# EAGLE design TT7-40 v1.1 (EAGLE 7.1.0)
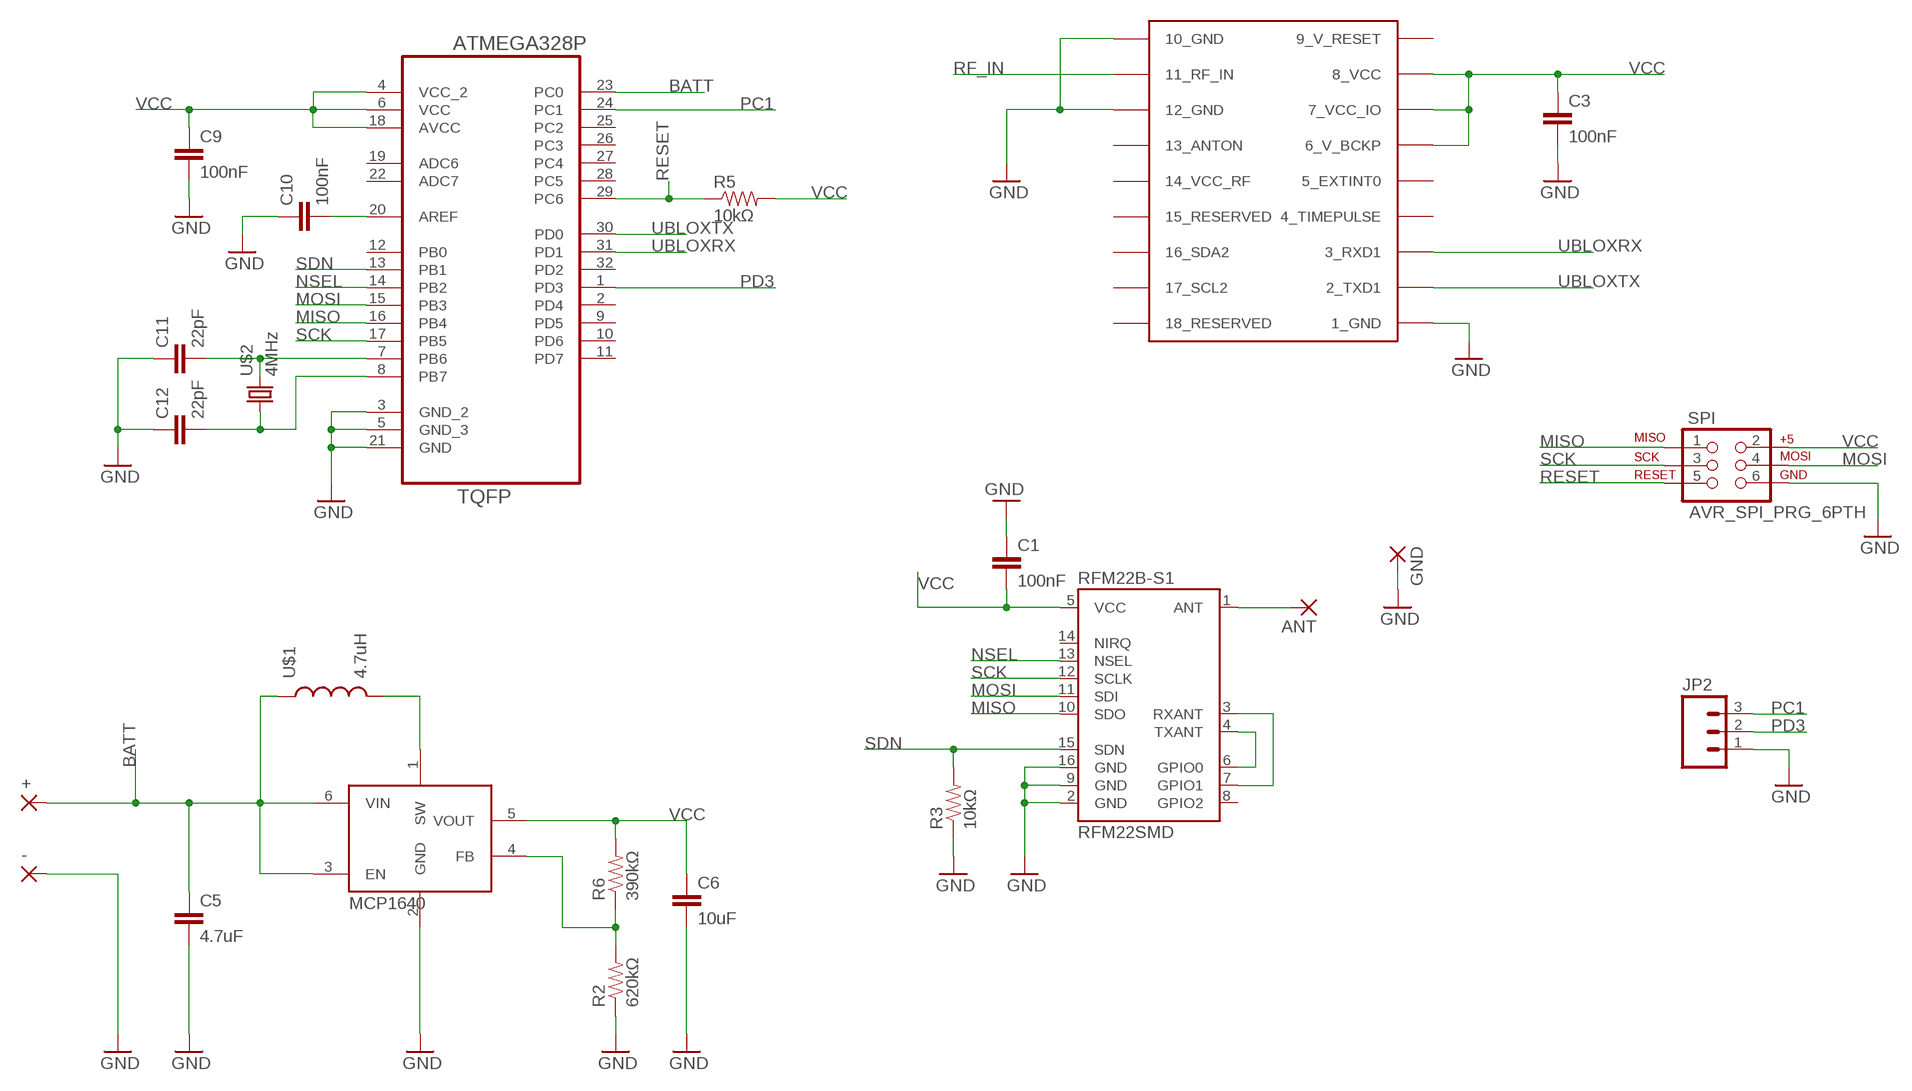
[diagram p0: schematic, sheet 1]

## Parts
+  WIREPADSMD1,27-254  [SMD1,27-2,54]
-  WIREPADSMD1,27-254  [SMD1,27-2,54]
ANT  WIREPADSMD1,27-254  [SMD1,27-2,54]
C1  100nF  CAP1206  [1206]
C3  100nF  CAP1206  [1206]
C5  4.7uF  CAP1206  [1206]
C6  10uF  CAP1206  [1206]
C9  100nF  CAP1206  [1206]
C10  100nF  CAP1206  [1206]
C11  22pF  CAP0805  [0805]
C12  22pF  CAP0805  [0805]
GND  WIREPADSMD1,27-254  [SMD1,27-2,54]
JP2  M03PTH  [1X03]
R2  620kΩ  RESISTOR0805-RES  [0805]
R3  10kΩ  RESISTOR0603-RES  [0603-RES]
R5  10kΩ  RESISTOR0603-RES  [0603-RES]
R6  390kΩ  RESISTOR0805-RES  [0805]
RFM22B-S1  RFM22SMD  [RFM22-XXX-S2]
SPI  AVR_SPI_PRG_6PTH  [2X3]
U2  MCP1640  [SOT23-6]
U3  ATMEGA328P-AU  [QFP80P900X900X120-32N]
U$1  4.7uH  DER07050705  [DER0705]
U$2  4MHz  ABRACON_ABM3_CRYSTALABM03_HC49  [ABM03_HC49]
UBLOX-MAX7C  UBLOX_MAX  [UBLOX_MAX]

## Nets
BATT: +.1(P) C5.1 U2.3(EN) U2.6(VIN) U3.23(PC0) U$1.P$1
GND: -.1(P) C1.1 C3.2 C5.2 C6.2 C9.2 C10.1 C11.1 C12.1 GND.1(P) JP2.1 R2.1 R3.1 RFM22B-S1.2(GND) RFM22B-S1.9(GND) RFM22B-S1.16(GND) SPI.6 U2.2(GND) U3.3(GND_2) U3.5(GND_3) U3.21(GND) UBLOX-MAX7C.1_GND UBLOX-MAX7C.10_GND UBLOX-MAX7C.12_GND
MISO: RFM22B-S1.10(SDO) SPI.1 U3.16(PB4)
MOSI: RFM22B-S1.11(SDI) SPI.4 U3.15(PB3)
N$2: RFM22B-S1.4(TXANT) RFM22B-S1.6(GPIO0)
N$3: RFM22B-S1.3(RXANT) RFM22B-S1.7(GPIO1)
N$10: ANT.1(P) RFM22B-S1.1(ANT)
N$22: U2.1(SW) U$1.P$2
N$33: C11.2 U3.7(PB6) U$2.2
N$34: R2.2 R6.1 U2.4(FB)
N$42: C12.2 U3.8(PB7) U$2.1
N$63: C10.2 U3.20(AREF)
NSEL: RFM22B-S1.13(NSEL) U3.14(PB2)
PC1: JP2.3 U3.24(PC1)
PD3: JP2.2 U3.1(PD3)
RESET: R5.1 SPI.5 U3.29(PC6)
RF_IN: UBLOX-MAX7C.11_RF_IN
SCK: RFM22B-S1.12(SCLK) SPI.3 U3.17(PB5)
SDN: R3.2 RFM22B-S1.15(SDN) U3.13(PB1)
UBLOXRX: U3.31(PD1) UBLOX-MAX7C.3_RXD1
UBLOXTX: U3.30(PD0) UBLOX-MAX7C.2_TXD1
VCC: C1.2 C3.1 C6.1 C9.1 R5.2 R6.2 RFM22B-S1.5(VCC) SPI.2 U2.5(VOUT) U3.4(VCC_2) U3.6(VCC) U3.18(AVCC) UBLOX-MAX7C.6_V_BCKP UBLOX-MAX7C.7_VCC_IO UBLOX-MAX7C.8_VCC
Unconnected: RFM22B-S1.8(GPIO2) RFM22B-S1.14(NIRQ) U3.2(PD4) U3.9(PD5) U3.10(PD6) U3.11(PD7) U3.12(PB0) U3.19(ADC6) U3.22(ADC7) U3.25(PC2) U3.26(PC3) U3.27(PC4) U3.28(PC5) U3.32(PD2) UBLOX-MAX7C.4_TIMEPULSE UBLOX-MAX7C.5_EXTINT0 UBLOX-MAX7C.13_ANTON UBLOX-MAX7C.14_VCC_RF UBLOX-MAX7C.15_RESERVED UBLOX-MAX7C.16_SDA2 UBLOX-MAX7C.17_SCL2 UBLOX-MAX7C.18_RESERVED

## Power pins joined to a net without a drawn wire
9_V_RESET: UBLOX-MAX7C.9_V_RESET

## Library data of the parts
+ - ANT GND = wirepad:WIREPAD: Wire PAD connect wire on PCB
C1 C3 C5 C6 C9-C12 = SparkFun-Capacitors:CAP: Capacitor Standard 0603 ceramic capacitor, and 0.1" leaded capacitor.
JP2 = SparkFun-Connectors:M03: Header 3 Standard 3-pin 0.1" header. Use with straight break away headers (SKU : PRT-00116), right angle break away headers (PRT-00553), swiss pins (PRT-00743), machine pins (PRT-00117), and female headers (PRT-00115). Molex polarized connector foot print use with SKU : PRT-08232 with associated crimp pins and housings.
R2 R6 = SparkFun-Resistors:RESISTOR: Resistor Basic schematic elements and footprints for 0603, 1206, and PTH resistors.
R3 R5 = SparkFun-Passives:RESISTOR: Resistor Basic schematic elements and footprints for 0603, 1206, and PTH resistors.
RFM22B-S1 = SparkFun-RF:RFM22: The RFM22 is a low-power, low cost radio that is capable of operating in the 434MHz and 900MHz open bands. It's frequency is software defined and there are some very good libraries written for it.
SPI = SparkFun-Connectors:AVR_SPI_PRG_6: AVR ISP 6 Pin This is the reduced ISP connector for AVR programming. Common on Arduino. This footprint will take up less PCB space and can be used with a 10-pin to 6-pin adapter such as SKU: BOB-08508 **Special note about "TEST_POINT" package. The stop mask is on the top side, so if you want your programming test points to be on the bottom of your board, make sure to place this package on the bottom side of the board. This also ensure that the orientation to program from the bottom side will be correct.
U2 = karlnet-parts:MCP1640: MCP1623, 1624, 1640/B/C/D pwm/pfm or pwm only DC/DC converters, in SOT-23
U3 = Ava:ATMEGA328P-AU; DESCRIPTION: 8-bit Microcontroller with In-System Programmable Flash; MPN: ATMEGA328P-AU; OC_FARNELL: 1715486; OC_NEWARK: 14R4631; PACKAGE: TQFP-32; SUPPLIER: Atmel
U$1 = SparkFun-Passives:DER0705: Inductor DER0705
U$2 = Ava:ABRACON_ABM3_CRYSTAL
UBLOX-MAX7C = Ava:UBLOX_MAX: UBLOX MAX

## Board
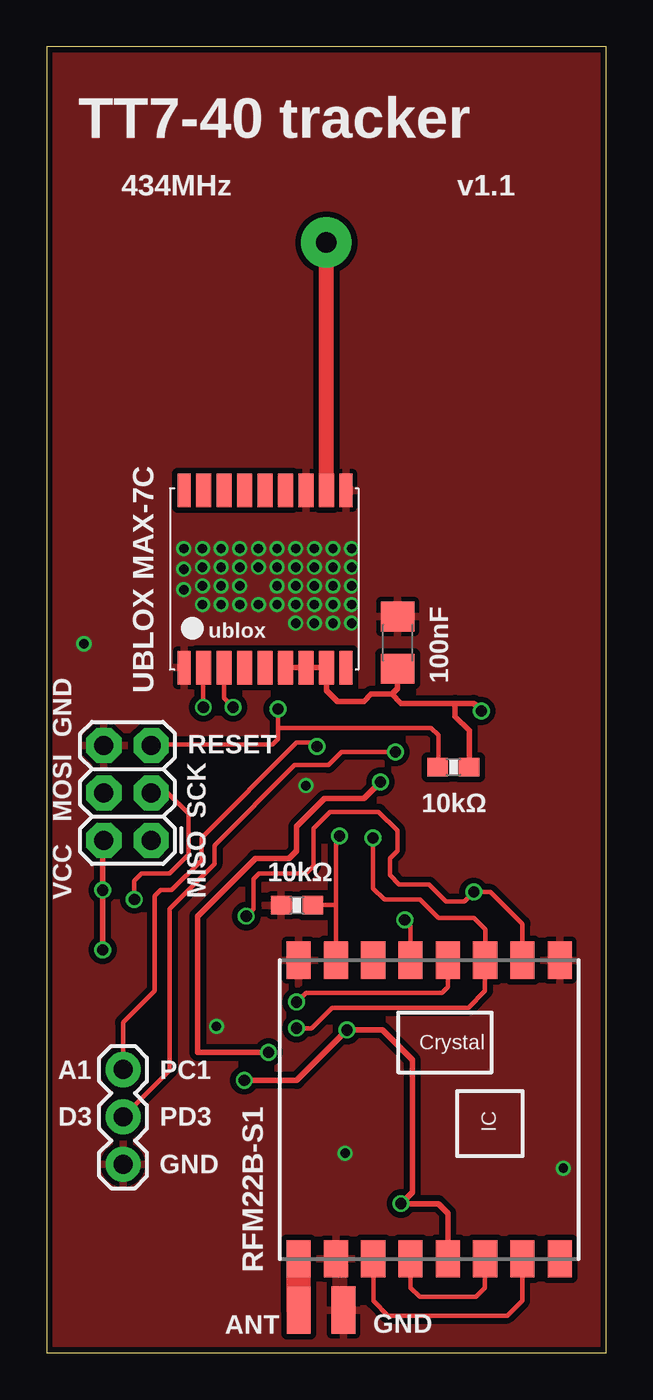
[diagram p1: board, top side]
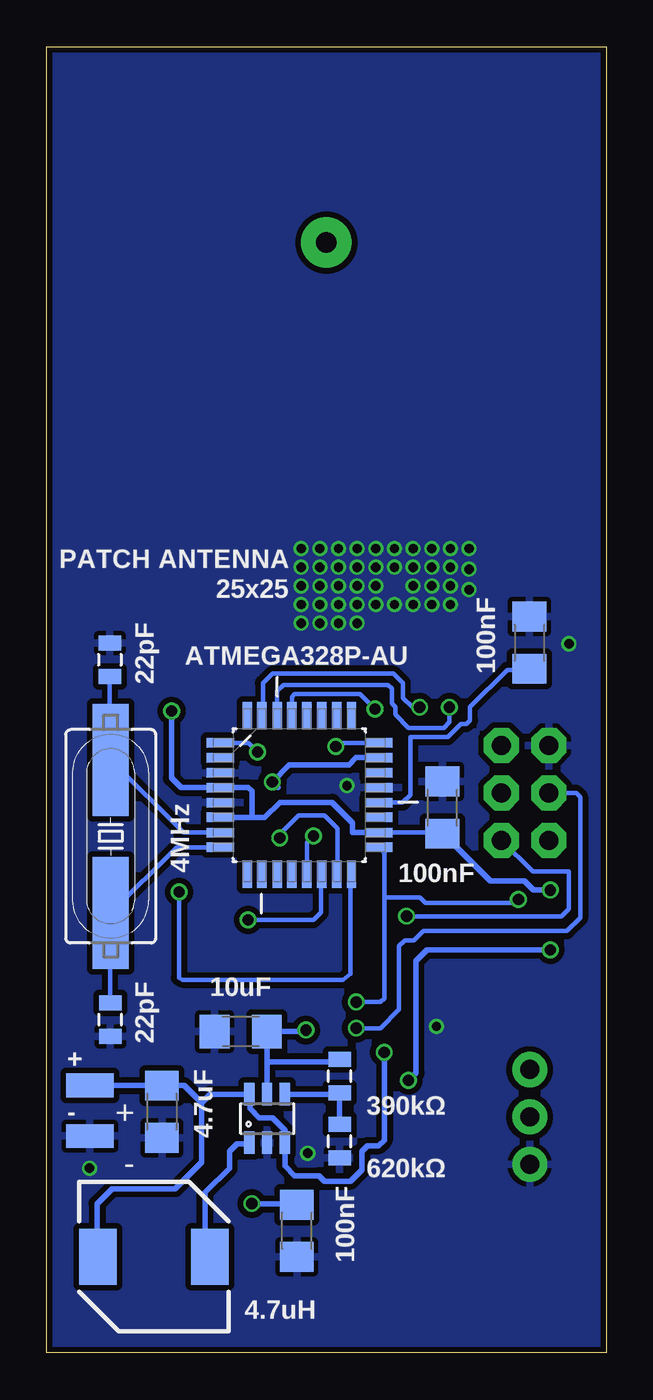
[diagram p2: board, bottom side, seen from below]

Size 30 x 70 mm. Coordinates in mm from the lower left corner, seen from the top.
Outline: 0,0 30,0 30,70 0,70 0,0
Copper layers (1*16): Top 0.035mm / dielectric 1.5mm / Bottom 0.035mm
Design rules "dirt_cheap_dirty_boards.v1": minimum track width 5mil, minimum drill 12mil, track to track 5mil, track to pad 5mil, pad to pad 5mil, via to via 5mil, smd to smd 0mil, copper to edge 10mil, drill to drill 10mil, minimum pad ring 10mil, minimum via ring 6mil, stop-mask expansion 2mil, vias tented up to drill 25mil, thermal gap 10mil

### Footprints (pad centres in the part's own frame; a part is rotated, then mirrored left to right if it is on the bottom)
SMD1,27-2,54 = smd 1.27 x 2.54: 1 0,0
1206 = smd 1.6 x 1.8: 1 -1.4,0; 2 1.4,0
0805 = smd 0.8 x 1.2: 1 -0.9,0; 2 0.9,0
1X03 = drill 1.016 pad 1.88: 1 0,0; 2 2.54,0; 3 5.08,0
0603-RES = smd 1.1 x 1: 1 -0.85,0; 2 0.85,0
RFM22-XXX-S2 = smd 2 x 1.3: 1 -8,7; 2 -8,5; 3 -8,3; 4 -8,1; 5 -8,-1; 6 -8,-3; 7 -8,-5; 8 -8,-7; 9 8,-7; 10 8,-5; 11 8,-3; 12 8,-1; 13 8,1; 14 8,3; 15 8,5; 16 8,7
2X3 = drill 1.016 pad 1.88 octagon: 1 0,0; 2 0,2.54; 3 2.54,0; 4 2.54,2.54; 5 5.08,0; 6 5.08,2.54
SOT23-6 = smd 0.55 x 1.2: 1 -0.95,-1.3; 2 0,-1.3; 3 0.95,-1.3; 4 0.95,1.3; 5 0,1.3; 6 -0.95,1.3
QFP80P900X900X120-32N = smd 1.473 x 0.508: 1 -4.242,2.794; 2 -4.242,2.007; 3 -4.242,1.194; 4 -4.242,0.406; 5 -4.242,-0.406; 6 -4.242,-1.194; 7 -4.242,-2.007; 8 -4.242,-2.794; 17 4.242,-2.794; 18 4.242,-2.007; 19 4.242,-1.194; 20 4.242,-0.406; 21 4.242,0.406; 22 4.242,1.194; 23 4.242,2.007; 24 4.242,2.794 | smd 0.508 x 1.473: 9 -2.794,-4.242; 10 -2.007,-4.242; 11 -1.194,-4.242; 12 -0.406,-4.242; 13 0.406,-4.242; 14 1.194,-4.242; 15 2.007,-4.242; 16 2.794,-4.242; 25 2.794,4.242; 26 2.007,4.242; 27 1.194,4.242; 28 0.406,4.242; 29 -0.406,4.242; 30 -1.194,4.242; 31 -2.007,4.242; 32 -2.794,4.242
DER0705 = smd 2 x 3: P$1 -3,0; P$2 3,0
ABM03_HC49 = smd 6 x 1.93: 1 -4.1,0; 2 4.1,0
UBLOX_MAX = smd 1.8 x 0.7: 1_GND 4.95,-4.4; 9_V_RESET 4.95,4.3; 10_GND -4.55,4.3; 18_RESERVED -4.55,-4.4 | smd 1.8 x 0.8: 2_TXD1 4.95,-3.35; 3_RXD1 4.95,-2.25; 4_TIMEPULSE 4.95,-1.15; 5_EXTINT0 4.95,-0.05; 6_V_BCKP 4.95,1.05; 7_VCC_IO 4.95,2.15; 8_VCC 4.95,3.25; 11_RF_IN -4.55,3.25; 12_GND -4.55,2.15; 13_ANTON -4.55,1.05; 14_VCC_RF -4.55,-0.05; 15_RESERVED -4.55,-1.15; 16_SDA2 -4.55,-2.25; 17_SCL2 -4.55,-3.35

### Placement (x,y rotation side)
+  27.68,14.33 90 bottom
-  27.68,11.62 90 bottom
ANT  13.51,2.28 0 top
C1  16.58,6.54 90 bottom
C3  18.82,38.06 90 top
C5  23.82,12.92 270 bottom
C6  19.6,17.22 180 bottom
C9  8.78,29.22 90 bottom
C10  4.12,38.06 270 bottom
C11  26.61,37.14 270 bottom
C12  26.59,17.85 90 bottom
GND  15.91,2.29 0 top
JP2  4.1,10.1 90 top
R2  14.29,11.34 90 bottom
R3  13.42,23.99 0 top
R5  21.81,31.39 0 top
R6  14.29,14.83 90 bottom
RFM22B-S1  20.51,13.04 90 top
SPI  5.61,27.47 90 top
U2  18.18,12.56 0 bottom
U3  16.45,29.89 0 bottom
U$1  24.25,5.16 0 bottom
U$2  26.56,27.68 90 bottom
UBLOX-MAX7C  11.76,41.67 270 top

### Tracks (layer width: path | path; a pad name or v marks a point on that pad's centre or on a via)
BATT  (via drill 0.6)
  Top 0.305: v17.9,30.6 17,29.7 14.9,29.7 13.4,28.2 13.4,26.9 13,26.5 11.2,26.5 8.1,23.4 8.1,16.1 v11.9,16.1
  Bottom 0.305: +.1 C5.1 | C5.1 | C5.1 22.63,14.33 21.7,13.4 | 21.7,13.4 21.7,10.2 23.1,8.8 26.5,8.8 27.3,8 27.3,5.21 U$1.P$1 | 21.7,13.4 21.24,13.86 U2.6 19.1,13.83 19.1,13.1 18.6,12.6 17.9,12.6 17.23,11.93 U2.3 17.23,10.03 16.7,9.5 15.4,9.5 15.1,9.2 13.7,9.2 13.1,9.8 13.1,10.8 12.8,11.1 12.2,11.1 11.9,11.4 v11.9,16.1 | U3.23 13.4,31.9 13.8,31.5 17,31.5 v17.9,30.6 17.6,30.3
GND  (via drill 0.5, 0.5 pad 0.25)
  other vias: 27.7,9.9 2,38 13.9,30.4 16,10.7 9.1,17.5 7.35,43.1 7.35,42 7.35,40.9 8.35,43.1 9.35,43.1 10.35,43.1 11.35,43.1 12.35,43.1 13.35,43.1 14.35,43.1 15.35,43.1 15.35,42.1 15.35,41.1 15.35,40.1 15.35,39.1 14.35,39.1 13.35,39.1 13.35,40.1 14.35,40.1 14.35,41.1 13.35,41.1 13.35,42.1 14.35,42.1 12.35,42.1 11.35,42.1 12.35,41.1 12.35,40.1 11.35,40.1 10.35,40.1 9.35,40.1 8.35,40.1 8.35,41.1 8.35,42.1 9.35,42.1 10.35,42.1 10.35,41.1 9.35,41.1 16.35,39.1 16.35,40.1 16.35,41.1 16.35,42.1 16.35,43.1
  pour Bottom (isolate 0.305): 0,70 30,70 30,0 0,0
  pour Top (isolate 0.305): 0,70 30,70 30,0 0,0
MISO  (via drill 0.6)
  Top 0.254: RFM22B-S1.10 25.51,22.99 23.8,24.7 v22.9,24.7 22.4,24.2 21.4,24.2 20.5,25.1 18.9,25.1 18.4,25.6 18.4,26.5 18.8,26.9 18.8,28 17.8,29 15.2,29 14.3,28.1 14.3,26.1 13.9,25.7 11.4,25.7 11.1,25.4 11.1,23.8 v10.7,23.4
  Bottom 0.254: v22.9,24.7 22.9,20.1 22.7,20 14.1,20 13.7,20.3 13.7,25.6 U3.16 | v10.7,23.4 2.4,23.4 2,23.8 2,25.8 3.94,25.8 SPI.1
MOSI  (via drill 0.6)
  Top 0.254: v17.5,27.6 17.5,24.9 18.1,24.3 20,24.3 21,23.3 22.9,23.3 23.51,22.69 RFM22B-S1.11 23.5,19.4 22.6,18.5 15.3,18.5 14.2,17.4 v13.4,17.4
  Bottom 0.254: v17.5,27.6 17.5,27.8 16.5,28.8 15.1,28.8 14.4,28.1 14.4,25.69 U3.15 | SPI.4 1.61,30.01 1.4,29.8 1.4,23.3 2.1,22.6 9.8,22.6 10.3,22.1 10.8,22.1 11.1,21.8 11.1,18.4 12.1,17.4 v13.4,17.4
N$2
  Top 0.254: RFM22B-S1.4 19.51,3.49 20,3 23,3 23.5,3.5 RFM22B-S1.6
N$3
  Top 0.254: RFM22B-S1.3 17.51,2.79 18.3,2 24.7,2 25.5,2.8 RFM22B-S1.7
N$10
  Top 0.254: 13.51,2.3 ANT.1
  Top 1.3: RFM22B-S1.1 13.51,2.3
N$22
  Bottom 0.305: U$1.P$2 21.5,5.41 21.5,8.6 20.2,9.9 20.2,10.8 19.8,11.2 19.19,11.2 U2.1
N$33
  Bottom 0.254: U3.7 22.66,27.88 U$2.2 26.61,31.83 C11.2
N$34
  Bottom 0.305: U2.4 14.66,13.86 R6.1 R2.2
N$42
  Bottom 0.254: U3.8 23.04,27.1 U$2.1 26.59,23.55 C12.2
N$63
  Bottom 0.254: U3.20 10.92,29.48 10.5,29.9 10.5,33 8.5,33 7.8,33.7 7.5,33.7 7.3,33.9 7.3,34.6 5.3,36.6 4.18,36.6 C10.2
NSEL  (via drill 0.6)
  Top 0.254: RFM22B-S1.13 19.51,22.89 v19.2,23.2
  Bottom 0.254: v19.2,23.2 15.7,23.2 15.3,23.6 15.3,25.6 U3.14
PC1  (via drill 0.6)
  Top 0.254: v14.5,32.5 14.3,32.7 13.4,32.7 8.3,27.6 8.3,26.4 6.7,24.8 6.1,24.8 5.8,24.5 5.8,19.4 4.1,17.7 JP2.3
  Bottom 0.254: U3.24 14.32,32.68 v14.5,32.5
PD3  (via drill 0.6)
  Top 0.254: v18.7,32.2 15.8,32.2 15.1,31.5 13.3,31.5 9,27.2 9,26.2 6.6,23.8 6.6,15.14 JP2.2
  Bottom 0.254: U3.1 19.18,32.68 v18.7,32.2
RESET  (via drill 0.6)
  Top 0.254: v12.4,34.5 12.4,33.5 | 12.4,33.5 12.4,32.9 12.1,32.6 5.66,32.6 SPI.5 | R5.1 20.96,31.04 21,31 21,33.1 20.6,33.5 12.4,33.5
  Bottom 0.254: U3.29 16.86,35.14 16.7,35.3 13.2,35.3 v12.4,34.5
RF_IN  (via drill 1.1 pad 2.7)
  Top 0.305: UBLOX-MAX7C.11_RF_IN 15.02,46.37
  Top 0.8: 15.02,46.37 v15,59.5
SCK  (via drill 0.6)
  Top 0.254: RFM22B-S1.12 21.51,19.61 21.2,19.3 13.9,19.3 v13.4,18.8 | SPI.3 6.49,30.01 7.6,28.9 7.6,26.7 6.6,25.7 5.1,25.7 4.7,25.3 v4.7,24.3
  Bottom 0.254: 11.9,24.4 11.9,19 12.1,18.8 v13.4,18.8 | 11.9,24.4 11.9,26.79 | 11.9,26.79 U3.17 | 11.9,26.79 11.9,26.9 12,27 | v4.7,24.3 4.9,24.1 9.7,24.1 10,24.4 11.9,24.4
SDN  (via drill 0.6)
  Top 0.254: RFM22B-S1.15 15.51,24 | 15.51,24 15.51,27.51 v15.7,27.7 | R3.2 15.51,24
  Bottom 0.254: v15.7,27.7 16.04,27.36 U3.13
UBLOXRX  (via drill 0.6)
  Top 0.254: UBLOX-MAX7C.3_RXD1 9.51,35.09 v10,34.6
  Bottom 0.254: v10,34.6 10.4,34.6 10.9,35.1 10.9,35.9 11.4,36.4 17.9,36.4 18.4,35.9 18.4,34.19 U3.31
UBLOXTX  (via drill 0.6)
  Top 0.254: v8.4,34.6 UBLOX-MAX7C.2_TXD1
  Bottom 0.254: U3.30 17.64,35.46 17.3,35.8 11.7,35.8 11.5,35.6 11.5,34.8 11.3,34.6 11.3,34.2 10.6,33.5 8.7,33.5 8.4,33.8 v8.4,34.6
VCC  (via drill 0.6)
  Top 0.305: RFM22B-S1.5 21.51,7.49 21,8 v19,8 19.6,8.6 19.6,15.7 18,17.3 v16.1,17.3 13.4,14.6 v10.6,14.6 | UBLOX-MAX7C.6_V_BCKP UBLOX-MAX7C.7_VCC_IO UBLOX-MAX7C.8_VCC 15.01,35.49 15.6,34.9 17,34.9 17.4,35.3 18.5,35.3 | 18.5,35.3 18.8,35.6 18.8,36.64 C3.1 | SPI.2 3,27.4 v3,24.8 v3,21.6 | 18.5,35.3 19,34.8 21.9,34.8 | 21.9,34.8 22.9,34.8 v23.3,34.4 | R5.2 22.66,33.34 21.9,34.1 21.9,34.8
  Bottom 0.254: U3.18 8.84,27.88 C9.1
  Bottom 0.305: v19,8 16.64,8 C1.2 | U2.5 18.18,15.5 | 18.18,15.5 18.18,17.2 C6.1 16.18,17.22 v16.1,17.3 | U3.6 19,28.7 | 19,28.7 18.3,28.7 17.5,29.5 14.7,29.5 13.6,28.4 13.6,27.9 13.58,27.88 U3.18 12.22,27.9 | 19,28.7 19,30.1 19.2,30.3 U3.4 22.8,30.3 23.3,30.8 v23.3,34.4 | C9.1 8.72,27.82 6.2,25.3 4.4,25.3 3.9,24.8 v3,24.8 | v10.6,14.6 10.2,15 10.2,21 9.6,21.6 v3,21.6 | R6.2 14.29,15.71 14.4,15.6 18.08,15.6 18.18,15.5

### Text on the board
tPlace: TT7-40 tracker | 434MHz | v1.1 | 100nF | UBLOX MAX-7C | GND | RESET | SCK | 10kΩ | MOSI | 10kΩ | VCC | MISO | A1 | PC1 | D3 | PD3 | GND | RFM22B-S1 | ANT | GND
bPlace: PATCH ANTENNA | 25x25 | 100nF | 22pF | ATMEGA328P-AU | 4MHz | 100nF | 22pF | 10uF | 4.7uF | + | 390kΩ | - | 620kΩ | 100nF | 4.7uH